# Altium schematic sheet Power+USB.SchDoc
size A3
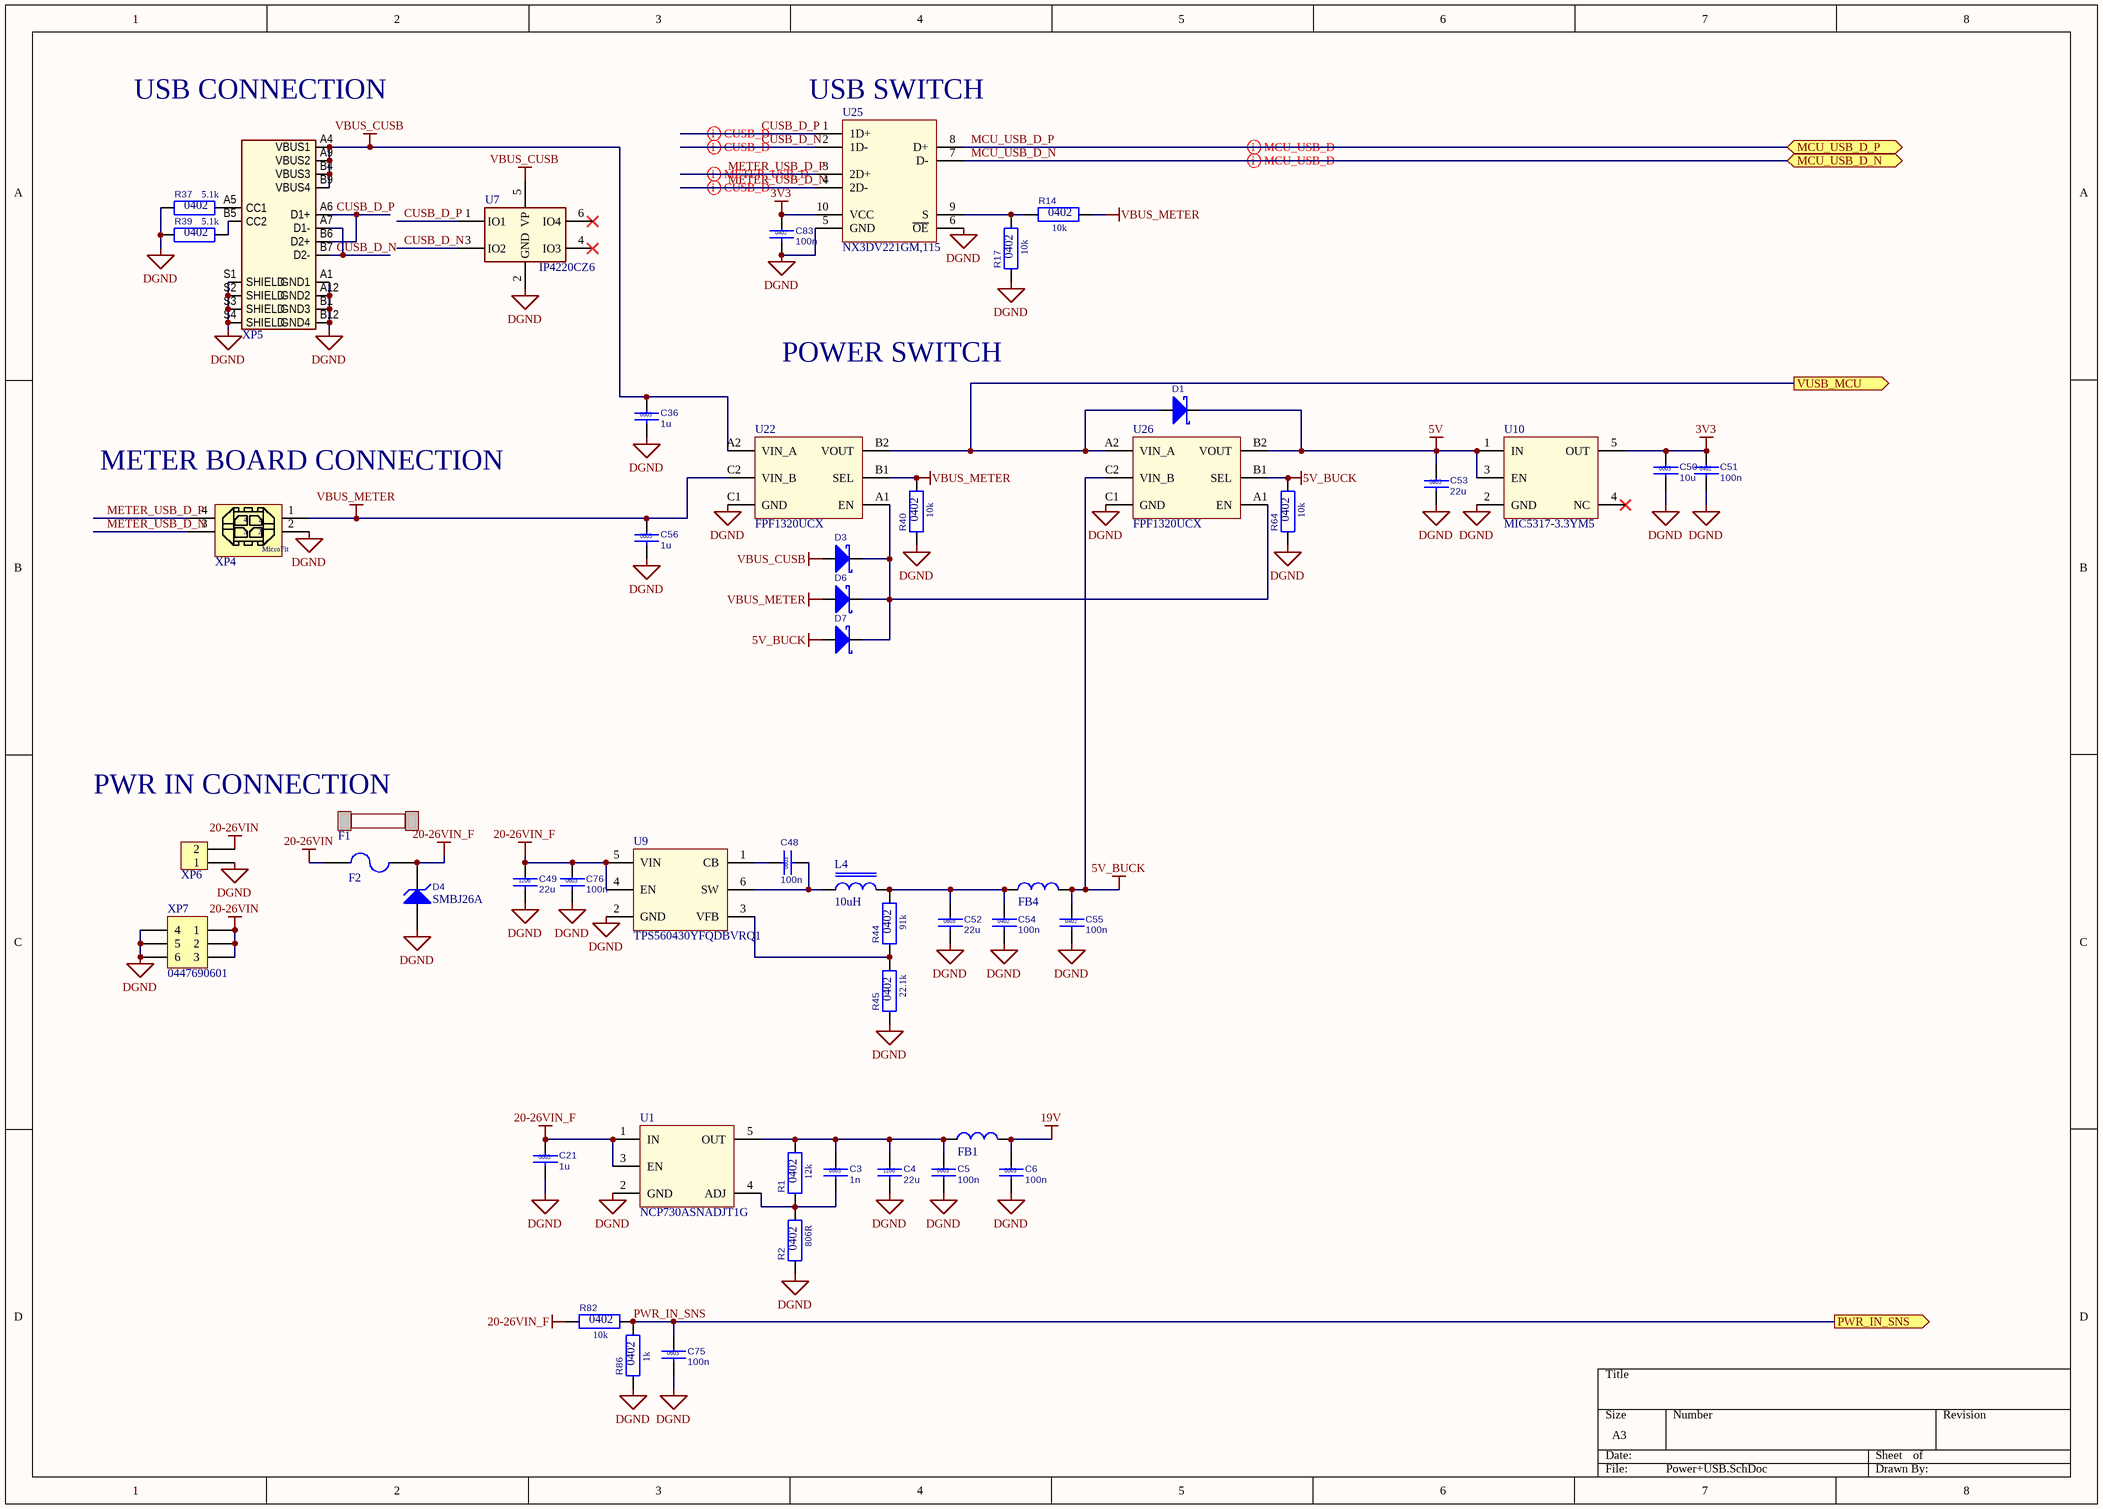
[diagram p0: Power+USB.SchDoc]

## Parts
C3  1n  Case: 0603  [CC0603M]
C4  22u  Case: 1206  [CC1206M]
C5  100n  Case: 0603  [CC0603M]
C6  100n  Case: 0603  [CC0603M]
C21  1u  Case: 0603  [CC0603M]
C36  1u  Case: 0603  [CC0603M]
C48  100n  Case: 0603  [CC0603M]
C49  22u  Case: 1206  [CC1206M]
C50  10u  Case: 0603  [CC0603M]
C51  100n  Case: 0402  [CC0402M]
C52  22u  Case: 0805  [CC0805M]
C53  22u  Case: 0805  [CC0805M]
C54  100n  Case: 0402  [CC0402M]
C55  100n  Case: 0402  [CC0402M]
C56  1u  Case: 0603  [CC0603M]
C75  100n  Case: 0603  [CC0603M]
C76  100n  Case: 0603  [CC0603M]
C83  100n  Case: 0402  [CC0402M]
D1  BAT54HT1G  [SOD323]  (value not drawn)
D3  BAT54HT1G  [SOD323]  (value not drawn)
D4  SMBJ26A  [SMB_UNI]
D6  BAT54HT1G  [SOD323]  (value not drawn)
D7  BAT54HT1G  [SOD323]  (value not drawn)
F1  0217015.MXP  (value not drawn)
F2  696108003002  [696108003002]  (value not drawn)
FB1  BLM18HG102SN1D  [FB0603M]  (value not drawn)
FB4  BLM21SP601SH1D  [FB0805M]  (value not drawn)
L4  10uH  [0518CDMCCDS]
R1  Case: 0402  [RC0402M]  (hidden comment: 12k)
R2  Case: 0402  [RC0402M]  (hidden comment: 806R)
R14  Case: 0402  [RC0402M]  (hidden comment: 10k)
R17  Case: 0402  [RC0402M]  (hidden comment: 10k)
R37  Case: 0402  [RC0402M]  (hidden comment: 5.1k)
R39  Case: 0402  [RC0402M]  (hidden comment: 5.1k)
R40  Case: 0402  [RC0402M]  (hidden comment: 10k)
R44  Case: 0402  [RC0402M]  (hidden comment: 91k)
R45  Case: 0402  [RC0402M]  (hidden comment: 22.1k)
R64  Case: 0402  [RC0402M]  (hidden comment: 10k)
R82  Case: 0402  [RC0402M]  (hidden comment: 10k)
R86  Case: 0402  [RC0402M]  (hidden comment: 1k)
U1  NCP730ASNADJT1G  [TSOP-5]
U7  IP4220CZ6  [TSOP-6]
U9  TPS560430YFQDBVRQ1  [SOT23-6]
U10  MIC5317-3.3YM5  [SOT23-5]
U22  FPF1320UCX  [WLCSP-6]
U25  NX3DV221GM,115  [XQFN-10(SOT1049-3)]
U26  FPF1320UCX  [WLCSP-6]
XP4  0447690401  [0447690401]  (value not drawn)
XP5  KUSBX-SL-CS1N14-B  [KUSBX-SL-CS1N14-B]  (value not drawn)
XP6  TBH-2x5.08P-RA-GN  [TBH-2x5.08P-RA-GN]  (value not drawn)
XP7  0447690601  [0447690601]

## Ports
MCU_USB_D_N (bidir), MCU_USB_D_P (bidir), PWR_IN_SNS (out), VUSB_MCU (out)

## Nets
3V3: C50.1 C51.1 C83.1 U10.5(OUT) U25.10(VCC)
5V: C53.1 D1.1(K) U10.1(IN) U10.3(EN) U26.B2(VOUT)
5V_BUCK: C55.1 D7.2(A) FB4.2 R64.2 U26.B1(SEL) U26.C2(VIN_B)
19V: C6.1 FB1.2
20-26VIN: F2.1 XP6.2 XP7.1 XP7.2 XP7.3
20-26VIN_F: C21.1 C49.1 C76.1 D4.1(K) F2.2 R82.1 U1.1(IN) U1.3(EN) U9.4(EN) U9.5(VIN)
DGND: C4.2 C5.2 C6.2 C21.2 C36.2 C49.2 C50.2 C51.2 C52.2 C53.2 C54.2 C55.2 C56.2 C75.2 C76.2 C83.2 D4.2(A) R2.1 R17.1 R37.1 R39.1 R40.1 R45.1 R64.1 R86.1 U1.2(GND) U7.2(GND) U9.2(GND) U10.2(GND) U22.C1(GND) U25.5(GND) U25.6(~{OE}) U26.C1(GND) XP4.2 XP5.A1(GND1) XP5.A12(GND2) XP5.B1(GND3) XP5.B12(GND4) XP5.S1(SHIELD) XP5.S2(SHIELD) XP5.S3(SHIELD) XP5.S4(SHIELD) XP6.1 XP7.4 XP7.5 XP7.6
VBUS_CUSB: C36.1 D3.2(A) U7.5(VP) U22.A2(VIN_A) XP5.A4(VBUS1) XP5.A9(VBUS2) XP5.B4(VBUS3) XP5.B9(VBUS4)
VBUS_METER: C56.1 D6.2(A) R14.2 R40.2 U22.B1(SEL) U22.C2(VIN_B) XP4.1
CUSB_D_N: U7.3(IO2) U25.2(1D-) XP5.A7(D1-) XP5.B7(D2-)
CUSB_D_P: U7.1(IO1) U25.1(1D+) XP5.A6(D1+) XP5.B6(D2+)
MCU_USB_D_N: U25.7(D-) ; port MCU_USB_D_N
MCU_USB_D_P: U25.8(D+) ; port MCU_USB_D_P
METER_USB_D_N: U25.4(2D-) XP4.3
METER_USB_D_P: U25.3(2D+) XP4.4
PWR_IN_SNS: C75.1 R82.2 R86.2 ; port PWR_IN_SNS
VUSB_MCU: D1.2(A) U22.B2(VOUT) U26.A2(VIN_A) ; port VUSB_MCU
NetC3_1: C3.1 C4.1 C5.1 FB1.1 R1.2 U1.5(OUT)
NetC3_2: C3.2 R1.1 R2.2 U1.4(ADJ)
NetC48_1: C48.1 U9.1(CB)
NetC48_2: C48.2 L4.1 U9.6(SW)
NetC52_1: C52.1 C54.1 FB4.1 L4.2 R44.2
NetD3_1: D3.1(K) D6.1(K) D7.1(K) U22.A1(EN) U26.A1(EN)
NetR14_1: R14.1 R17.2 U25.9(S)
NetR37_2: R37.2 XP5.A5(CC1)
NetR39_2: R39.2 XP5.B5(CC2)
NetR44_1: R44.1 R45.2 U9.3(VFB)

Not connected (* = marked no-connect by the designer): U7 4(IO3)* 6(IO4)*; U10 4(NC)*

## Layout directives
differential pair: CUSB_D_N, CUSB_D_P, MCU_USB_D_N, MCU_USB_D_P, METER_USB_D_N, METER_USB_D_P

## Notes on the sheet
- (near XP5) USB CONNECTION
- (near U25) USB SWITCH
- POWER SWITCH
- (near XP4) METER BOARD CONNECTION
- (near F1) PWR IN CONNECTION
- (in symbol 0447690401) MicroFit

## Library data of the parts
C3 = CC0603K-X7R-50V-1N-M: Chip ceramic capacitor; Manufacturer PN: CC0603KRX7R9BB102; Manufacturer: Yageo; Tollerance: 10%; Rated Voltage: 50V; Material: X7R; PartNumber: CC0603K-X7R-50V-1N-M; Value: 1n; Publisher: alexey.savchenko; Publishing Date: 1/12/2020
C4 C49 = CC1206K-X5R-35V-22U-M: Chip ceramic capacitor; Manufacturer PN: C3216X5R1V226M160AC; Manufacturer: TDK; Tollerance: 10%; Rated Voltage: 35V; Material: X5R; PartNumber: CC1206K-X5R-35V-22U-M; Value: 22u; Publisher: alexey.savchenko; Publishing Date: 3/30/2020
C5 C6 C48 C75 C76 = CC0603K-X7R-50V-100N-M: Chip ceramic capacitor; Manufacturer PN: CC0603KRX7R9BB104; Manufacturer: Yageo; Tollerance: 10%; Rated Voltage: 50V; Material: X7R; PartNumber: CC0603K-X7R-50V-100N-M; Value: 100n; Publisher: alexey.savchenko; Publishing Date: 1/12/2020
C21 = CC0603K-X5R-50V-1U-M: Chip ceramic capacitor; Manufacturer PN: CL10A105KB8NNNC; Manufacturer: Samsung; Tollerance: 10%; Rated Voltage: 50V; Material: X5R; PartNumber: CC0603K-X5R-50V-1U-M; Value: 1u; Publisher: alexey.savchenko; Publishing Date: 1/12/2020
C36 C56 = CC0603K-X7R-10V-1U-M: Chip ceramic capacitor; Manufacturer PN: CL10B105KP8NNNC; Manufacturer: Samsung; Tollerance: 10%; Rated Voltage: 10V; Material: X5R; PartNumber: CC0603K-X7R-10V-1U-M; Value: 1u; Publisher: alexey.savchenko; Publishing Date: 1/12/2020
C50 = CC0603K-X5R-10V-10U-M: Chip ceramic capacitor; Manufacturer PN: GRM188R61A106KE69D; Manufacturer: Murata; Tollerance: 10%; Rated Voltage: 10V; Material: X5R; PartNumber: CC0603K-X5R-10V-10U-M; Value: 10u; Publisher: alexey.savchenko; Publishing Date: 1/12/2020
C51 C54 C55 C83 = CC0402K-X7R-25V-100N-M: Chip ceramic capacitor; Manufacturer PN: GRM155R71E104KE14J; Manufacturer: Murata; Tollerance: 10%; Rated Voltage: 25V; Material: X7R; PartNumber: CC0402K-X7R-25V-100N-M; Value: 100n; Publisher: alexey.savchenko; Publishing Date: 1/12/2020
C52 C53 = CC0805K-X5R-10V-22U-M: Chip ceramic capacitor; Manufacturer PN: CL21A226KPCLRNC; Manufacturer: Samsung; Tollerance: 10%; Rated Voltage: 10V; Material: X5R; PartNumber: CC0805K-X5R-10V-22U-M; Value: 22u; Publisher: alexey.savchenko; Publishing Date: 2/17/2020
D1 D3 D6 D7 = BAT54HT1G: DIODE SCHOTTKY 30V 200MA SOD323; Manufacturer: ON Semiconductor; PartNumber: BAT54HT1G; Manufacturer PN: BAT54HT1G; Case: SOD323; Publisher: alexey.savchenko; Publishing Date: 2/17/2020
D4 = SMBJ26A: TVS DIODE Unidirectional 26V DO214AA; Manufacturer: Littelfuse Inc.; PartNumber: SMBJ26A; Manufacturer PN: SMBJ26A; Case: SMB_UNI; Publisher: alexey.savchenko; Publishing Date: 2/14/2020
F1 = 0217015.MXP: 15A 250V AC DC Fuse Cartridge, Glass Holder 5mm x 20mm; Manufacturer: Littlefuse; PartNumber: 0217015.MXP; Manufacturer PN: 0217015.MXP; Publisher: alexey.savchenko; Publishing Date: 2/14/2020
F2 = 696108003002: FUSEHOLDER BLOCKS - PCB - CLIP C; Manufacturer: Würth Elektronik; PartNumber: 696108003002; Manufacturer PN: 696108003002; Publisher: alexey.savchenko; Publishing Date: 2/14/2020
FB1 = BLM18HG102SN1D: FERRITE BEAD 1 KOHM 0603 1LN; Manufacturer: Murata; Resistance: 1000; PartNumber: BLM18HG102SN1D; Manufacturer PN: BLM18HG102SN1D; Publisher: alexey.savchenko; Publishing Date: 1/12/2020
FB4 = BLM21SP601SH1D: 600 Ohms @ 100MHz 1 Power Line Ferrite Bead 0805 (2012 Metric) 2.3A; Manufacturer: Murata; Resistance: 600; PartNumber: BLM21SP601SH1D; Manufacturer PN: BLM21SP601SH1D; Publisher: alexey.savchenko; Publishing Date: 2/17/2020
L4 = 0518CDMCCDS-100MC: 10µH Shielded Molded Inductor 2.3A 155mOhm Max Nonstandard; Manufacturer: Sumida; Tollerance: 20%; PartNumber: 0518CDMCCDS-100MC; Manufacturer PN: 0518CDMCCDS-100MC; Value: 10uH; Publisher: alexey.savchenko; Publishing Date: 4/1/2020
R1 = RC0402F-12K-M: Chip resistor; Manufacturer PN: RC0402FR-0712KL; Manufacturer: Yageo; Tollerance: 1%; Rated Voltage: 50V; Power: 0.063W; T Coefficient: 100ppm; Value: 12k; PartNumber: RC0402F-12K-M; Publisher: alexey.savchenko; Publishing Date: 2/24/2020
R2 = RC0402F-806R-M: Chip resistor; Manufacturer PN: RC0402FR-07806RL; Manufacturer: Yageo; Tollerance: 1%; Rated Voltage: 50V; Power: 0.063W; T Coefficient: 100ppm; Value: 806R; PartNumber: RC0402F-806R-M; Publisher: alexey.savchenko; Publishing Date: 2/24/2020
R14 R17 R40 R64 R82 = RC0402F-10K-M: Chip resistor; Manufacturer PN: RC0402FR-0710KL; Manufacturer: Yageo; Tollerance: 1%; Rated Voltage: 50V; Power: 0.063W; T Coefficient: 100ppm; Value: 10k; PartNumber: RC0402F-10K-M; Publisher: alexey.savchenko; Publishing Date: 2/24/2020
R37 R39 = RC0402F-5K1-M: Chip resistor; Manufacturer PN: RC0402FR-075K1L; Manufacturer: Yageo; Tollerance: 1%; Rated Voltage: 50V; Power: 0.063W; T Coefficient: 100ppm; Value: 5.1k; PartNumber: RC0402F-5K1-M; Publisher: alexey.savchenko; Publishing Date: 2/24/2020
R44 = RC0402F-91K-M: Chip resistor; Manufacturer PN: RC0402FR-0791KL; Manufacturer: Yageo; Tollerance: 1%; Rated Voltage: 50V; Power: 0.063W; T Coefficient: 100ppm; Value: 91k; PartNumber: RC0402F-91K-M; Publisher: alexey.savchenko; Publishing Date: 2/24/2020
R45 = RC0402F-22K1-M: Chip resistor; Manufacturer PN: RC0402FR-0722K1L; Manufacturer: Yageo; Tollerance: 1%; Rated Voltage: 50V; Power: 0.063W; T Coefficient: 100ppm; Value: 22.1k; PartNumber: RC0402F-22K1-M; Publisher: alexey.savchenko; Publishing Date: 2/24/2020
R86 = RC0402F-1K-M: Chip resistor; Manufacturer PN: RC0402FR-071KL; Manufacturer: Yageo; Tollerance: 1%; Rated Voltage: 50V; Power: 0.063W; T Coefficient: 100ppm; Value: 1k; PartNumber: RC0402F-1K-M; Publisher: alexey.savchenko; Publishing Date: 2/24/2020
U1 = NCP730ASNADJT1G: NCP730 TSOP-5 ADJ; Manufacturer: ON Semiconductor; PartNumber: NCP730ASNADJT1G; Manufacturer PN: NCP730ASNADJT1G; Case: TSOP-5; Publisher: alexey.savchenko; Publishing Date: 12/10/2020
U7 = IP4220CZ6: TVS DIODE 5.5V 6TSOP; Manufacturer: Nexperia; PartNumber: IP4220CZ6; Manufacturer PN: IP4220CZ6; Case: TSOP-6; Publisher: alexey.savchenko; Publishing Date: 1/24/2020
U9 = TPS560430YFQDBVRQ1: Buck Switching Regulator IC Positive Adjustable 1V 1 Output 600mA SOT-23-6; Manufacturer: TI; PartNumber: TPS560430YFQDBVRQ1; Manufacturer PN: TPS560430YFQDBVRQ1; Case: SOT23-6; Publisher: alexey.savchenko; Publishing Date: 3/31/2020
U10 = MIC5317-3.3YM5: Linear Voltage Regulator IC 1 Output 150mA SOT-23-5; Manufacturer: Microchip; PartNumber: MIC5317-3.3YM5; Manufacturer PN: MIC5317-3.3YM5; Case: SOT23-5; Publisher: alexey.savchenko; Publishing Date: 3/10/2020
U22 U26 = FPF1320UCX: Power Switch/Driver 2:1 P-Channel 1.5A 6-WLCSP (0.96x1.66); Manufacturer: ON Semiconductor; PartNumber: FPF1320UCX; Manufacturer PN: FPF1320UCX; Case: WLCSP-6; Publisher: alexey.savchenko; Publishing Date: 4/10/2020
U25 = NX3DV221GM,115: IC USB 2.0 SWITCH HS 10XQFN; Manufacturer: NXP; Analogs: PI3USB221AZUAEX; PartNumber: NX3DV221GM,115; Manufacturer PN: NX3DV221GM,115; Case: XQFN-10(SOT1049-3); Publisher: alexey.savchenko; Publishing Date: 4/9/2020
XP4 = 0447690401: Micro-Fit BMI Receptacle Header, Dual Row, Vertical, with Press-fit Plastic Pegs, 2.54µm Tin (Sn), 4 Circuits; Manufacturer: Molex; Analogs: 0447690402, 0447690403; PartNumber: 0447690401; Manufacturer PN: 0447690401; Publisher: alexey.savchenko; Publishing Date: 2/14/2020
XP5 = KUSBX-SL-CS1N14-B: CONN USB TYPE-C TH UPRIGHT FLAG; Manufacturer: Kycon; PartNumber: KUSBX-SL-CS1N14-B; Manufacturer PN: KUSBX-SL-CS1N14-B; Publisher: alexey.savchenko; Publishing Date: 4/17/2020
XP6 = TBH-2x5.08P-RA-GN: TERM BLOCK HDR 2POS 90DEG 5.08MM, Green; Manufacturer PN: +1757019(Plug); Manufacturer: Phoenix Contact; PartNumber: TBH-2x5.08P-RA-GN; Publisher: alexey.savchenko; Publishing Date: 2/14/2020
XP7 = 0447690601: Micro-Fit BMI Receptacle Header, Dual Row, Vertical, with Press-fit Plastic Pegs, 2.54µm Tin (Sn), 6 Circuits; Manufacturer: Molex; Analogs: 0447690602, 0447690603; PartNumber: 0447690601; Manufacturer PN: 0447690601; Publisher: alexey.savchenko; Publishing Date: 4/29/2020